# Altium project Arduino Nano ObstacleAvoid.PrjPcb
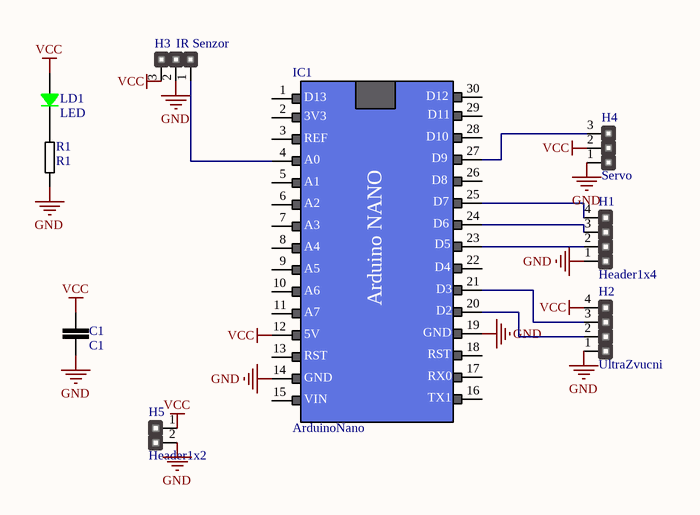
[diagram p0: Sheet1.SchDoc]
1 sheet, 9 parts. Net scope: global (net labels, ports and power ports of the same name join across sheets).
Board file: PCB1.PcbDoc

## Sheet Sheet1.SchDoc
size A

### Parts
C1  C1  [C1(ceramic)]
H1  Header1x4  [Header1x4]
H2  UltraZvucni  [Header1x4]
H3  IR Senzor  [Header 1x3]
H4  Servo  [Header 1x3]
H5  Header1x2  [Header1x2]
IC1  ArduinoNano  [Arduino Nano]
LD1  LED  [LED SMD 3528]
R1  R1  [R 0805]

### Nets
GND: C1.1 H1.1 H2.1 H3.2 H4.1 H5.2 IC1.14 IC1.19 R1.1
VCC: C1.2 H2.4 H3.3 H4.2 H5.1 IC1.12 LD1.1
NetH1_2: H1.2 IC1.23
NetH1_3: H1.3 IC1.24
NetH1_4: H1.4 IC1.25
NetH2_2: H2.2 IC1.20
NetH2_3: H2.3 IC1.21
NetH3_1: H3.1 IC1.4
NetH4_3: H4.3 IC1.27
NetLD1_2: LD1.2 R1.2

Not connected (* = marked no-connect by the designer): IC1 1 2 3 5 6 7 8 9 10 11 13 15 16 17 18 22 26 28 29 30

### Notes on the sheet
- (in symbol ArduinoNano) D12; D13; 3V3; D11; REF; D10; A0; D9; A1; D8; A2; D7; A3; D6; A4; D5; A5; D4; A6; D3; Arduino NANO; A7; D2; 5V; GND; RST; RX0; VIN; TX1

### Library data of the parts
H2 = Header1x4
H3 H4 = Header 1x3